# EasyEDA schematic SCH_XILINX JTAG-N_2022-10-28.json

## Sheets
1 MAIN: TITLE: Sheet_1; REV: 1.0; Date: 2022-08-10; Sheet: 1/1; Drawn By: Denjhang; Company: Your Company
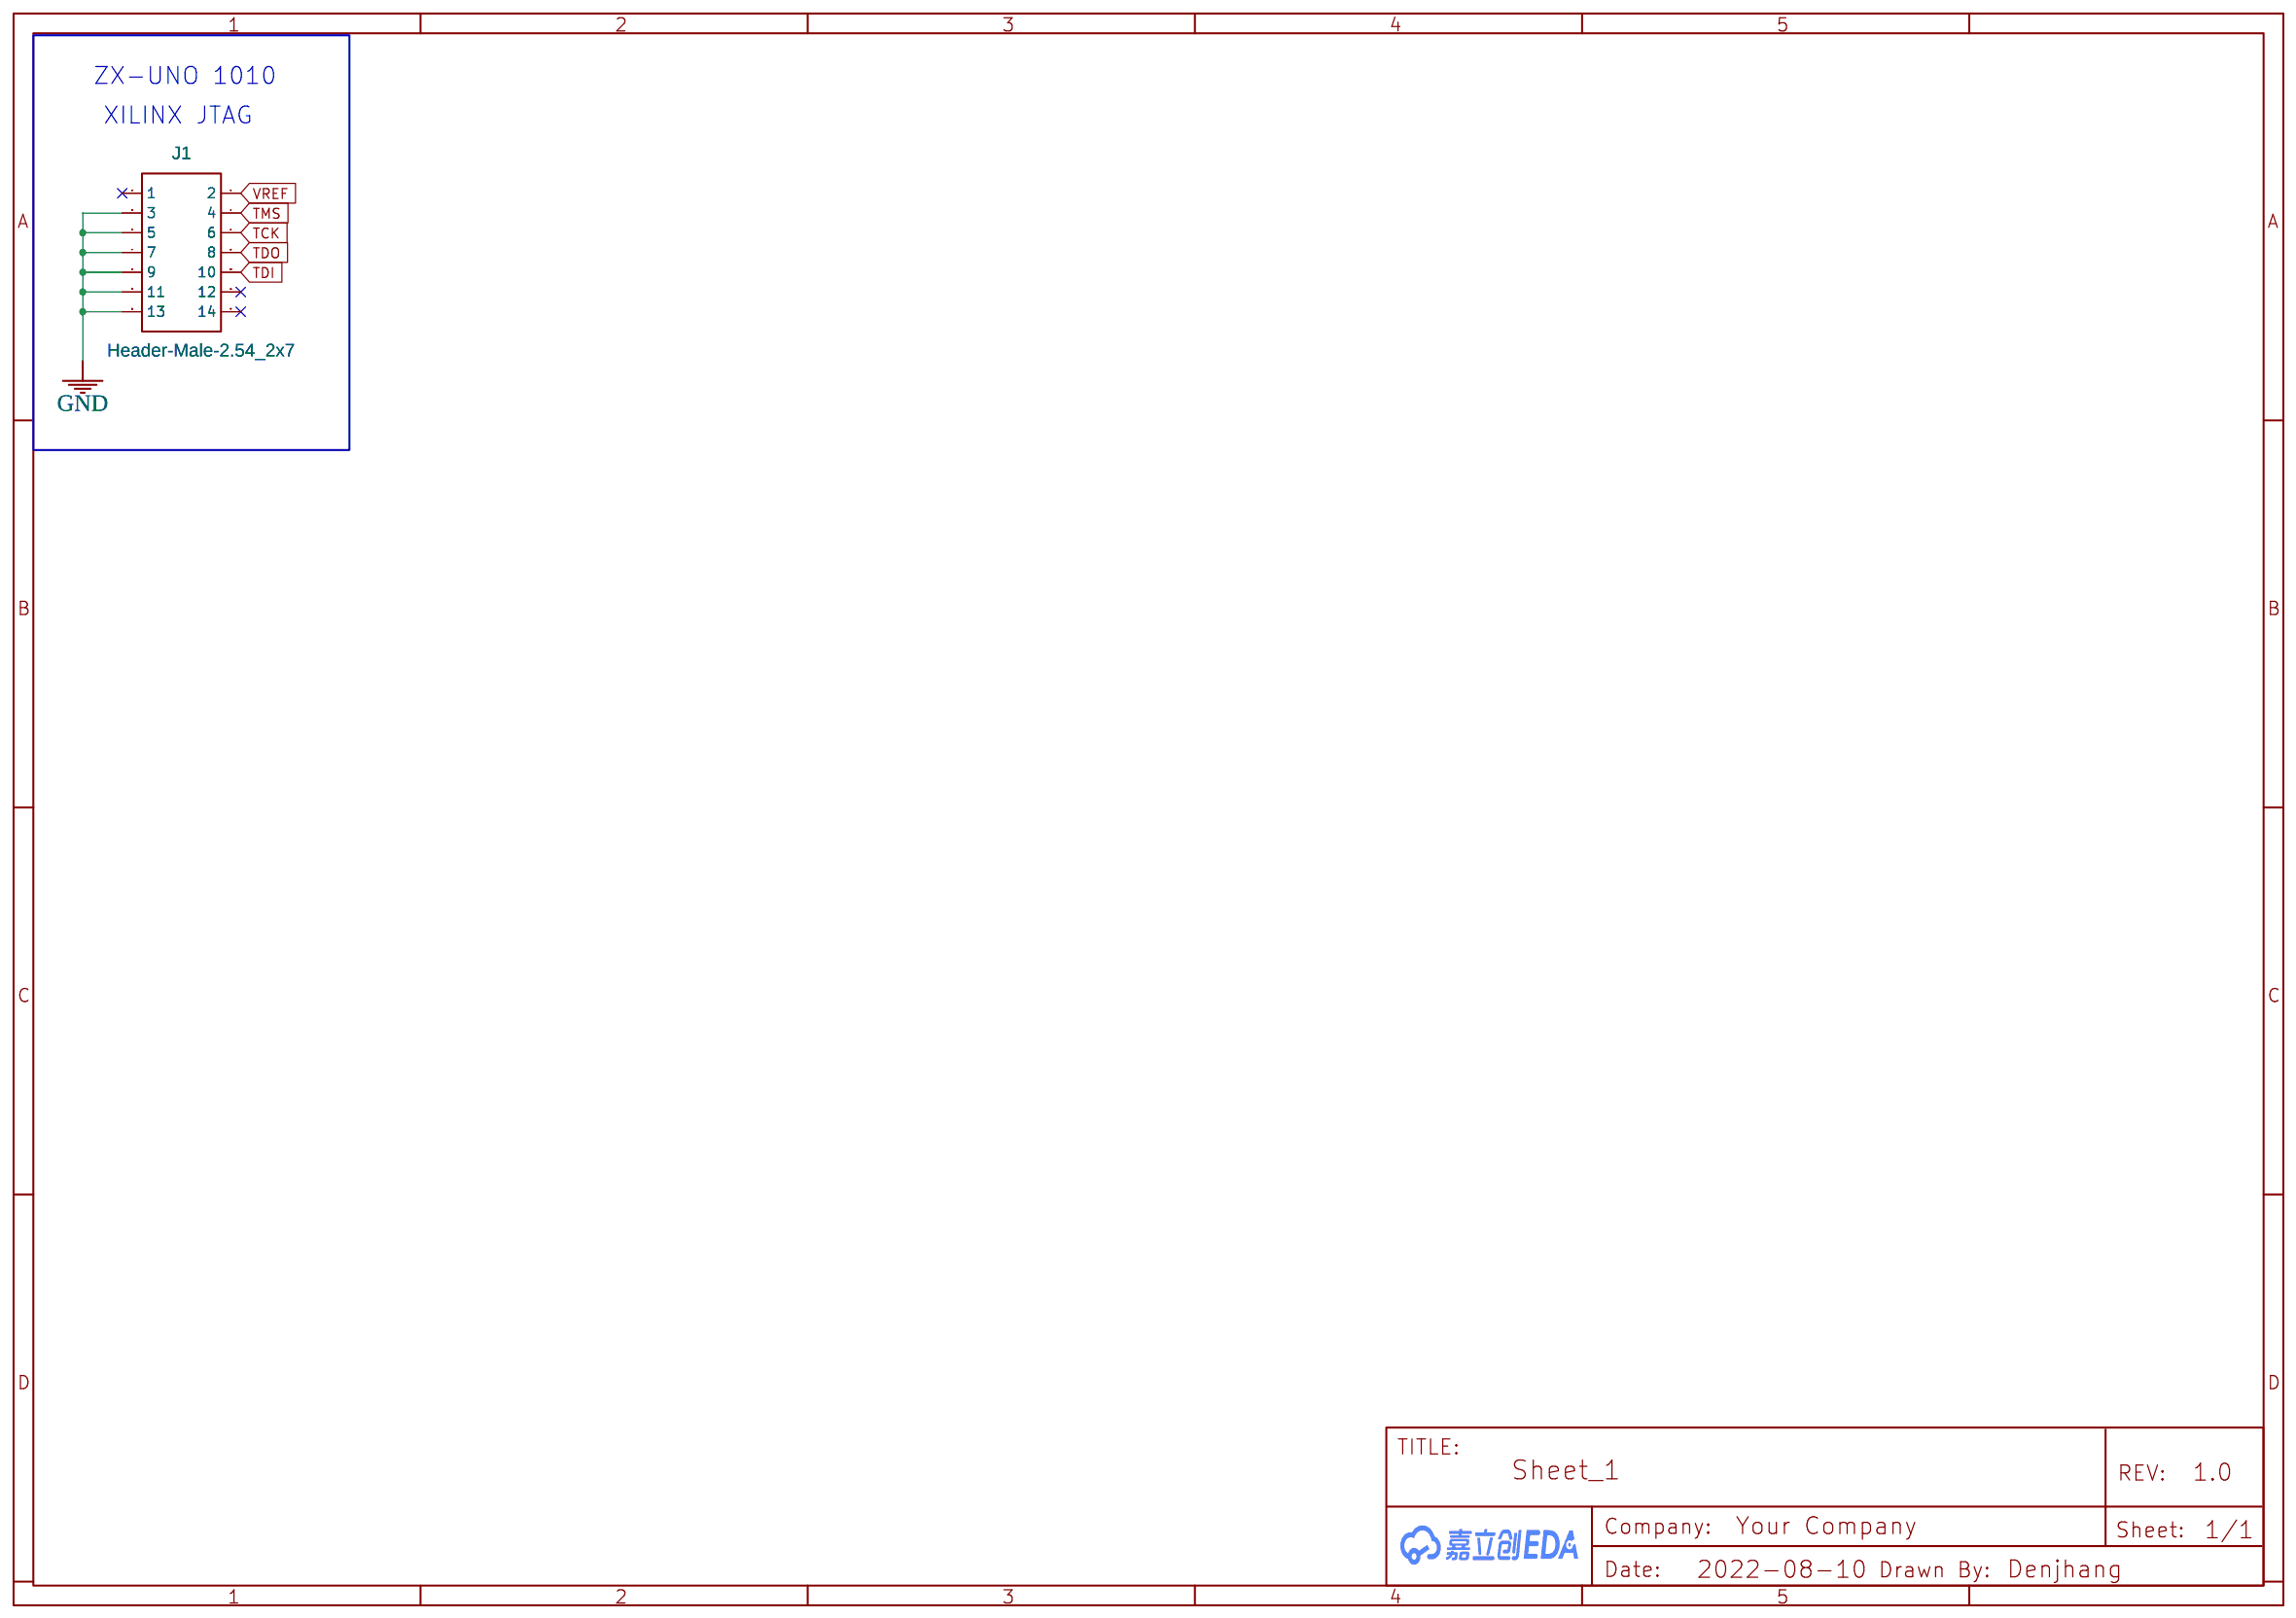
[diagram p0: MAIN]
2 SDMV1: TITLE: Sheet_2; Date: 2022-10-27
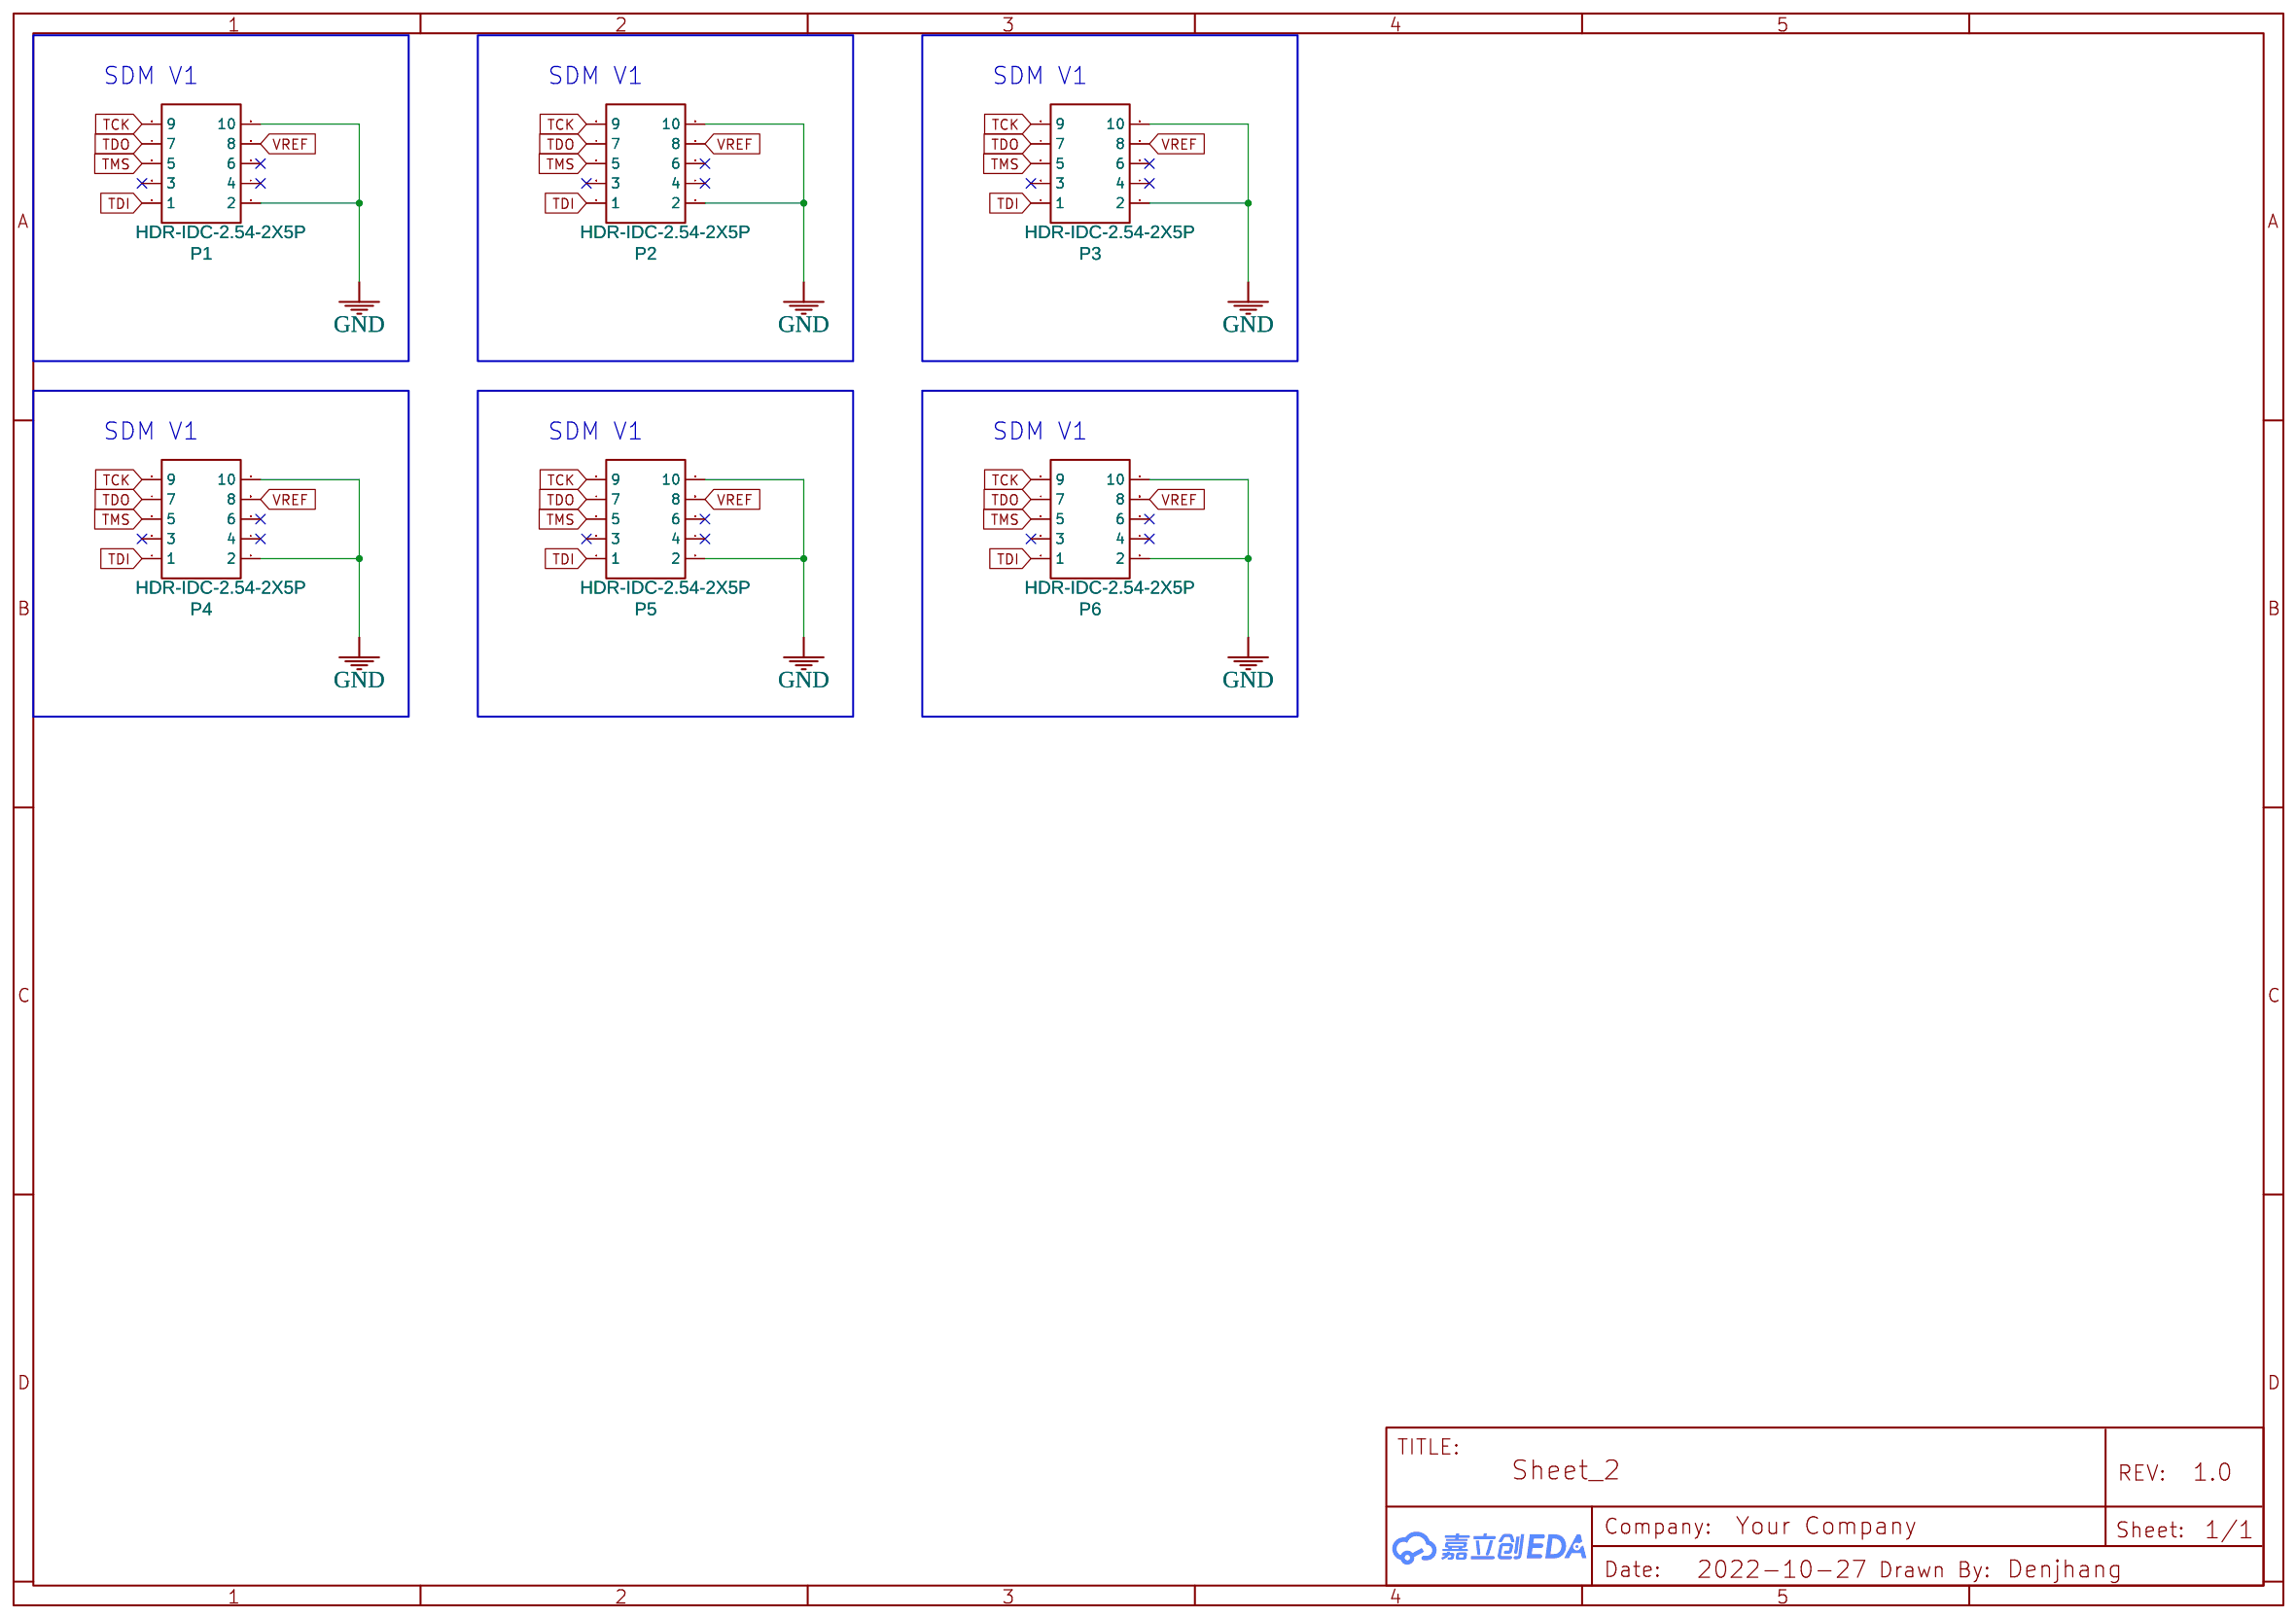
[diagram p1: SDMV1]
3 SDMV2: TITLE: Sheet_3; Date: 2022-10-27
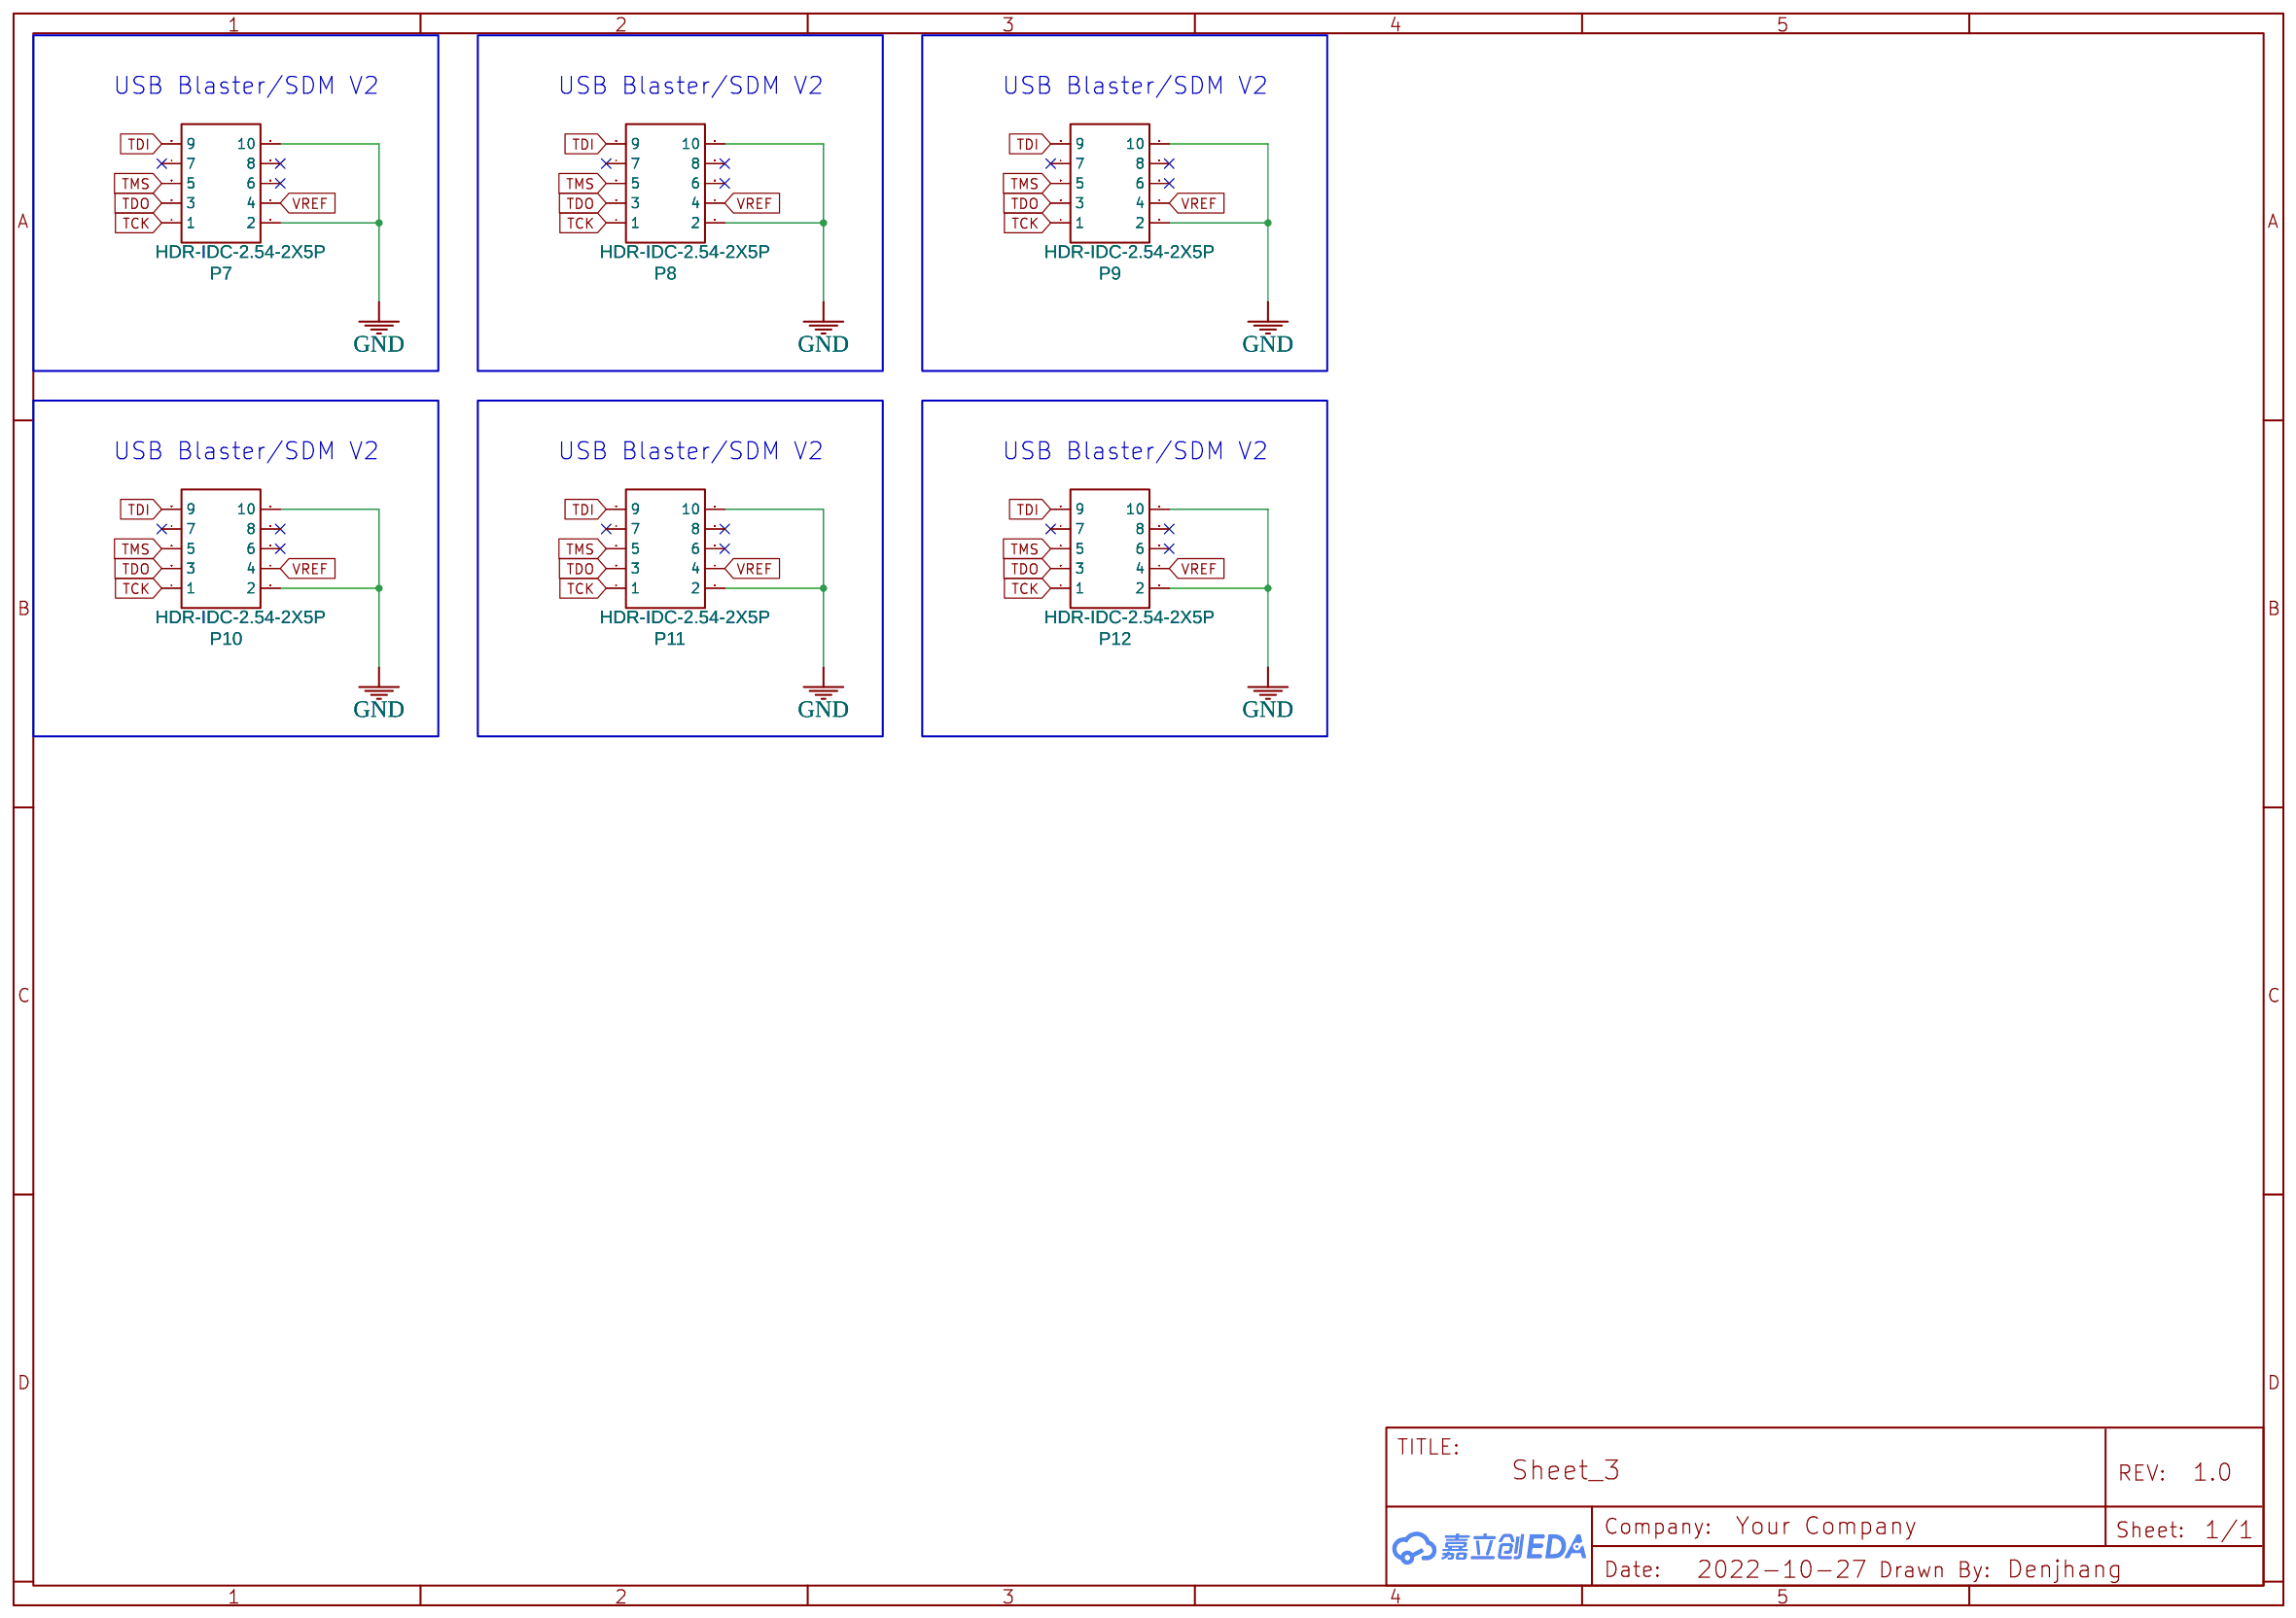
[diagram p2: SDMV2]

## Parts
sheet MAIN
J1  Header-Male-2.54_2x7  [HDR-TH_14P-P2.54-V-M-R2-C7-S2.54]
sheet SDMV1
P1  HDR-IDC-2.54-2X5P  [IDC-TH_10P-P2.54_C5665]
P2  HDR-IDC-2.54-2X5P  [IDC-TH_10P-P2.54_C5665]
P3  HDR-IDC-2.54-2X5P  [IDC-TH_10P-P2.54_C5665]
P4  HDR-IDC-2.54-2X5P  [IDC-TH_10P-P2.54_C5665]
P5  HDR-IDC-2.54-2X5P  [IDC-TH_10P-P2.54_C5665]
P6  HDR-IDC-2.54-2X5P  [IDC-TH_10P-P2.54_C5665]
sheet SDMV2
P7  HDR-IDC-2.54-2X5P  [IDC-TH_10P-P2.54_C5665]
P8  HDR-IDC-2.54-2X5P  [IDC-TH_10P-P2.54_C5665]
P9  HDR-IDC-2.54-2X5P  [IDC-TH_10P-P2.54_C5665]
P10  HDR-IDC-2.54-2X5P  [IDC-TH_10P-P2.54_C5665]
P11  HDR-IDC-2.54-2X5P  [IDC-TH_10P-P2.54_C5665]
P12  HDR-IDC-2.54-2X5P  [IDC-TH_10P-P2.54_C5665]

## Library data of the parts
J1 = Header-Male-2.54_2x7: Supplier: LCSC; Manufacturer: BOOMELE; Manufacturer Part: Double row of needle2X7P 2.54mm; Supplier Part: C71397; JLCPCB Part Class: Extended Part
P1-P12 = HDR-IDC-2.54-2X5P: Supplier: LCSC; Manufacturer: BOOMELE; Manufacturer Part: IDC Box 2.54mm 2X5P; Supplier Part: C5665; JLCPCB Part Class: Extended Part

## Nets
GND: J1.3 J1.5 J1.7 J1.9 J1.11 J1.13 P1.2 P1.10 P2.2 P2.10 P3.2 P3.10 P4.2 P4.10 P5.2 P5.10 P6.2 P6.10 P7.2 P7.10 P8.2 P8.10 P9.2 P9.10 P10.2 P10.10 P11.2 P11.10 P12.2 P12.10
TCK: J1.6 P1.9 P2.9 P3.9 P4.9 P5.9 P6.9 P7.1 P8.1 P9.1 P10.1 P11.1 P12.1
TDI: J1.10 P1.1 P2.1 P3.1 P4.1 P5.1 P6.1 P7.9 P8.9 P9.9 P10.9 P11.9 P12.9
TDO: J1.8 P1.7 P2.7 P3.7 P4.7 P5.7 P6.7 P7.3 P8.3 P9.3 P10.3 P11.3 P12.3
TMS: J1.4 P1.5 P2.5 P3.5 P4.5 P5.5 P6.5 P7.5 P8.5 P9.5 P10.5 P11.5 P12.5
VREF: J1.2 P1.8 P2.8 P3.8 P4.8 P5.8 P6.8 P7.4 P8.4 P9.4 P10.4 P11.4 P12.4

Not connected (* = marked no-connect by the designer): J1 1* 12* 14*; P1 3* 4* 6*; P2 3* 4* 6*; P3 3* 4* 6*; P4 3* 4* 6*; P5 3* 4* 6*; P6 3* 4* 6*; P7 6* 7* 8*; P8 6* 7* 8*; P9 6* 7* 8*; P10 6* 7* 8*; P11 6* 7* 8*; P12 6* 7* 8*

## Notes on the sheets
sheet 1
- ZX-UNO 1010
- XILINX JTAG
sheet 2
- SDM V1
- SDM V1
- SDM V1
- SDM V1
- SDM V1
- SDM V1
sheet 3
- USB Blaster/SDM V2
- USB Blaster/SDM V2
- USB Blaster/SDM V2
- USB Blaster/SDM V2
- USB Blaster/SDM V2
- USB Blaster/SDM V2
